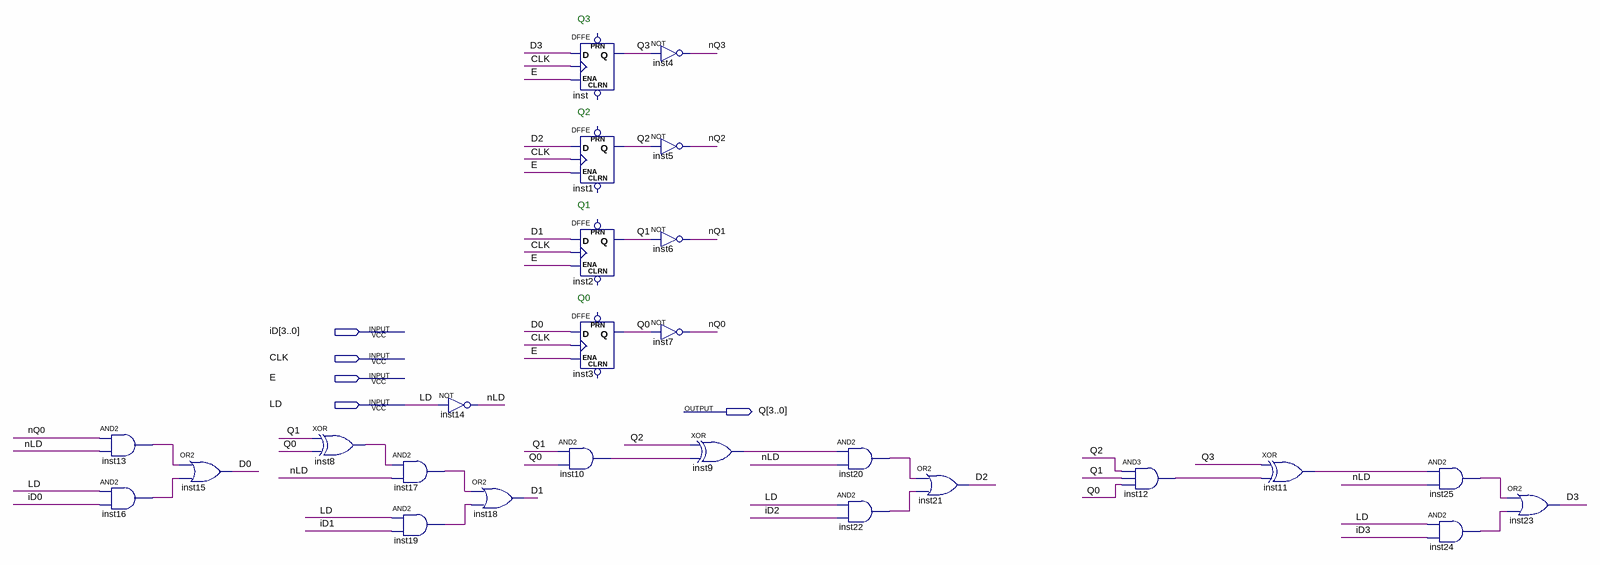
[diagram p0: schematic sheet]
// Quartus schematic CNT4b.bdf as structural Verilog: 26 symbols, 5 pins
module CNT4b (
  input  [3:0] iD,
  input  CLK,
  input  E,
  input  LD,
  output [3:0] Q
);

  wire D0, D1, D2, D3, inst8_out, inst9_out, inst10_out, inst11_out, inst12_out, inst13_out, inst16_out,
       inst17_out, inst19_out, inst20_out, inst22_out, inst24_out, inst25_out, nLD, nQ0, nQ1, nQ2, nQ3;

  and inst13 (inst13_out, nQ0, nLD);
  and inst16 (inst16_out, LD, iD[0]);
  or inst15 (D0, inst13_out, inst16_out);
  xor inst8 (inst8_out, Q[1], Q[0]);
  and inst17 (inst17_out, inst8_out, nLD);
  and inst19 (inst19_out, LD, iD[1]);
  not inst14 (nLD, LD);
  or inst18 (D1, inst17_out, inst19_out);
  DFFE inst (.D(D3), .CLK(CLK), .ENA(E), .Q(Q[3]));  // open: PRN, CLRN
  DFFE inst1 (.D(D2), .CLK(CLK), .ENA(E), .Q(Q[2]));  // open: PRN, CLRN
  DFFE inst2 (.D(D1), .CLK(CLK), .ENA(E), .Q(Q[1]));  // open: PRN, CLRN
  DFFE inst3 (.D(D0), .CLK(CLK), .ENA(E), .Q(Q[0]));  // open: PRN, CLRN
  and inst10 (inst10_out, Q[1], Q[0]);
  not inst4 (nQ3, Q[3]);
  not inst5 (nQ2, Q[2]);
  not inst6 (nQ1, Q[1]);
  not inst7 (nQ0, Q[0]);
  xor inst9 (inst9_out, Q[2], inst10_out);
  and inst20 (inst20_out, inst9_out, nLD);
  and inst22 (inst22_out, LD, iD[2]);
  or inst21 (D2, inst20_out, inst22_out);
  and inst12 (inst12_out, Q[2], Q[1], Q[0]);
  xor inst11 (inst11_out, Q[3], inst12_out);
  and inst25 (inst25_out, inst11_out, nLD);
  and inst24 (inst24_out, LD, iD[3]);
  or inst23 (D3, inst25_out, inst24_out);

  // Notes on the sheet:
  //   Q3
  //   Q2
  //   Q1
  //   Q0
endmodule
